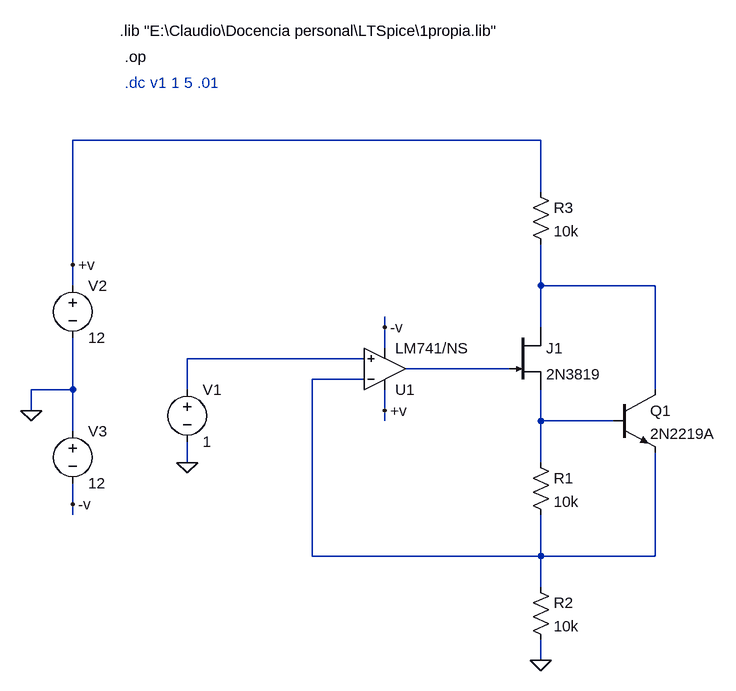
[diagram p0: schematic fuente de corriente 1.asc]
fuente de corriente 1.asc, the LTspice schematic file:
Version 4
SHEET 1 880 680
WIRE 224 -160 -496 -160
WIRE 224 -80 224 -160
WIRE -496 32 -496 -160
WIRE -496 64 -496 32
WIRE 224 64 224 0
WIRE 400 64 224 64
WIRE -16 128 -16 112
WIRE 224 128 224 64
WIRE -16 160 -16 128
WIRE -48 176 -320 176
WIRE 176 192 16 192
WIRE -48 208 -128 208
WIRE -496 224 -496 144
WIRE -496 224 -560 224
WIRE -320 224 -320 176
WIRE 400 224 400 64
WIRE -560 256 -560 224
WIRE -16 256 -16 224
WIRE -16 272 -16 256
WIRE 224 272 224 224
WIRE 336 272 224 272
WIRE -496 288 -496 224
WIRE -320 336 -320 304
WIRE 224 336 224 272
WIRE -496 400 -496 368
WIRE -496 416 -496 400
WIRE -128 480 -128 208
WIRE 224 480 224 416
WIRE 224 480 -128 480
WIRE 400 480 400 320
WIRE 400 480 224 480
WIRE 224 528 224 480
WIRE 224 640 224 608
FLAG 224 640 0
FLAG -320 336 0
FLAG -560 256 0
FLAG -496 32 +v
FLAG -496 400 -v
FLAG -16 256 +v
FLAG -16 128 -v
DATAFLAG 288 272 ""
DATAFLAG 288 64 ""
DATAFLAG 144 192 ""
DATAFLAG 384 480 ""
SYMBOL njf 176 128 R0
SYMATTR InstName J1
SYMATTR Value 2N3819
SYMBOL npn 336 224 R0
SYMATTR InstName Q1
SYMATTR Value 2N2219A
SYMBOL res 208 320 R0
SYMATTR InstName R1
SYMATTR Value 10k
SYMBOL res 208 512 R0
SYMATTR InstName R2
SYMATTR Value 10k
SYMBOL OpAmps\\opamp2 -16 256 M180
SYMATTR InstName U1
SYMATTR Value LM741/NS
SYMBOL voltage -320 208 R0
WINDOW 123 0 0 Left 0
WINDOW 39 0 0 Left 0
SYMATTR InstName V1
SYMATTR Value 1
SYMBOL voltage -496 48 R0
WINDOW 123 0 0 Left 0
WINDOW 39 0 0 Left 0
SYMATTR InstName V2
SYMATTR Value 12
SYMBOL voltage -496 272 R0
WINDOW 123 0 0 Left 0
WINDOW 39 0 0 Left 0
SYMATTR InstName V3
SYMATTR Value 12
SYMBOL res 208 -96 R0
SYMATTR InstName R3
SYMATTR Value 10k
TEXT -424 -328 Left 2 !.lib "E:\\Claudio\\Docencia personal\\LTSpice\\1propia.lib"
TEXT -416 -288 Left 2 !.op
TEXT -416 -248 Left 2 ;.dc v1 1 5 .01

The netlist it stands for:
* fuente de corriente 1.asc
J1 N001 N003 N005 2N3819
Q1 N001 N005 N004 0 2N2219A
R1 N005 N004 10k
R2 N004 0 10k
XU1 N002 N004 +v -v N003 LM741/NS  ; pins In+ In- V+ V- OUT
V1 N002 0 1
V2 +v 0 12
V3 0 -v 12
R3 +v N001 10k
.model NPN NPN
.model PNP PNP
.lib standard.bjt
.model NJF NJF
.model PJF PJF
.lib standard.jft
.lib "E:\Claudio\Docencia personal\LTSpice\1propia.lib"
.op
* .dc v1 1 5 .01
.backanno
.end